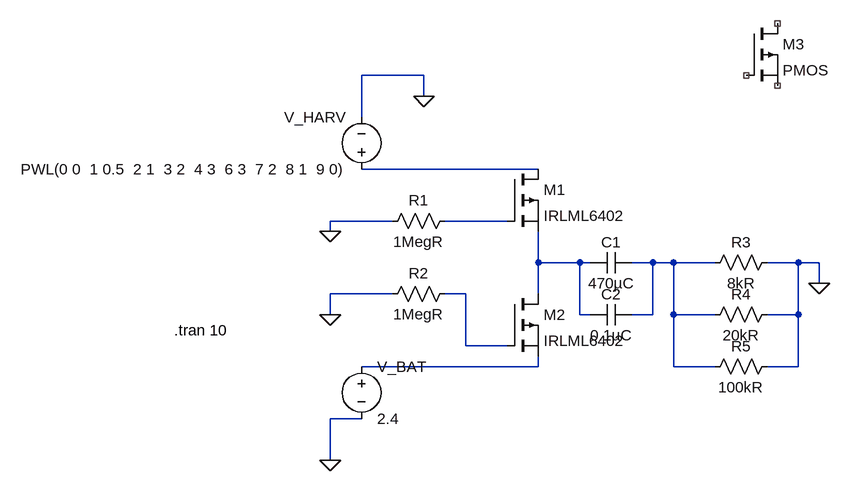
[diagram p0: schematic switching_circuit.asc]
switching_circuit.asc, the LTspice schematic file:
Version 4.1
SHEET 1 1104 680
WIRE 48 -48 -48 -48
WIRE 48 -16 48 -48
WIRE -48 16 -48 -48
WIRE 224 96 -48 96
WIRE 0 176 -96 176
WIRE 176 176 80 176
WIRE -96 192 -96 176
WIRE 224 240 224 192
WIRE 288 240 224 240
WIRE 304 240 288 240
WIRE 400 240 368 240
WIRE 432 240 400 240
WIRE 496 240 432 240
WIRE 624 240 576 240
WIRE 656 240 624 240
WIRE 656 272 656 240
WIRE 0 288 -96 288
WIRE 112 288 80 288
WIRE 224 288 224 240
WIRE -96 320 -96 288
WIRE 288 320 288 240
WIRE 304 320 288 320
WIRE 400 320 400 240
WIRE 400 320 368 320
WIRE 432 320 432 240
WIRE 496 320 432 320
WIRE 624 320 624 240
WIRE 624 320 576 320
WIRE 112 368 112 288
WIRE 176 368 112 368
WIRE 224 400 224 384
WIRE 224 400 -48 400
WIRE 432 400 432 320
WIRE 496 400 432 400
WIRE 624 400 624 320
WIRE 624 400 576 400
WIRE -48 480 -96 480
WIRE -96 544 -96 480
FLAG -96 320 0
FLAG -96 192 0
FLAG 48 -16 0
FLAG -96 544 0
FLAG 656 272 0
SYMBOL voltage -48 112 R180
WINDOW 0 24 96 Left 2
WINDOW 3 24 16 Left 2
WINDOW 123 0 0 Left 0
WINDOW 39 0 0 Left 0
SYMATTR InstName V_HARV
SYMATTR Value PWL(0 0  1 0.5  2 1  3 2  4 3  6 3  7 2  8 1  9 0)
SYMBOL voltage -48 384 R0
WINDOW 123 0 0 Left 0
WINDOW 39 0 0 Left 0
SYMATTR InstName V_BAT
SYMATTR Value 2.4
SYMBOL pmos 176 96 R0
SYMATTR InstName M1
SYMATTR Value IRLML6402
SYMBOL pmos 176 288 R0
SYMATTR InstName M2
SYMATTR Value IRLML6402
SYMBOL res 96 160 R90
WINDOW 0 0 56 VBottom 2
WINDOW 3 32 56 VTop 2
SYMATTR InstName R1
SYMATTR Value 1MegR
SYMBOL res 96 272 R90
WINDOW 0 0 56 VBottom 2
WINDOW 3 32 56 VTop 2
SYMATTR InstName R2
SYMATTR Value 1MegR
SYMBOL res 592 224 R90
WINDOW 0 0 56 VBottom 2
WINDOW 3 32 56 VTop 2
SYMATTR InstName R3
SYMATTR Value 8kR
SYMBOL res 592 304 R90
WINDOW 0 0 56 VBottom 2
WINDOW 3 32 56 VTop 2
SYMATTR InstName R4
SYMATTR Value 20kR
SYMBOL res 592 384 R90
WINDOW 0 0 56 VBottom 2
WINDOW 3 32 56 VTop 2
SYMATTR InstName R5
SYMATTR Value 100kR
SYMBOL cap 368 224 R90
WINDOW 0 0 32 VBottom 2
WINDOW 3 32 32 VTop 2
SYMATTR InstName C1
SYMATTR Value 470µC
SYMBOL cap 368 304 R90
WINDOW 0 0 32 VBottom 2
WINDOW 3 32 32 VTop 2
SYMATTR InstName C2
SYMATTR Value 0.1µC
SYMBOL pmos 544 -128 R0
SYMATTR InstName M3
TEXT -336 344 Left 2 !.tran 10

The netlist it stands for:
* switching_circuit.asc
V_HARV N001 0 PWL(0 0  1 0.5  2 1  3 2  4 3  6 3  7 2  8 1  9 0)
V_BAT N006 0 2.4
M1 N001 N002 N003 N003 IRLML6402
M2 N003 N005 N006 N006 IRLML6402
R1 N002 0 1MegR
R2 N005 0 1MegR
R3 0 N004 8kR
R4 0 N004 20kR
R5 0 N004 100kR
C1 N004 N003 470µC
C2 N004 N003 0.1µC
M3 NC_01 NC_02 NC_03 NC_03 PMOS
.model NMOS NMOS
.model PMOS PMOS
.lib standard.mos
.tran 10
.backanno
.end